# EAGLE design DoubleBoard_TypeC (EAGLE 9.5.2)
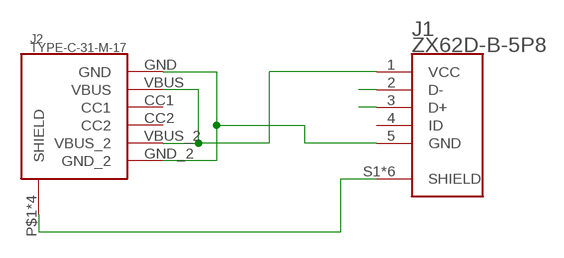
[diagram p0: schematic, sheet 1]

## Parts
J1  ZX62D-B-5P8  [HRS_ZX62D-B-5P8]
J2  TYPE-C-31-M-17  [TYPE-C-31-M-17]

## Nets
D+: J1.3(D+)
D-: J1.2(D-)
GND [power]: J1.5(GND) J2.GND J2.GND_2
SHIELD [power]: J1.S1(SHIELD) J1.S2(SHIELD) J1.S3(SHIELD) J1.S4(SHIELD) J1.S5(SHIELD) J1.S6(SHIELD) J2.P$1(SHIELD) J2.P$2(SHIELD) J2.P$3(SHIELD) J2.P$4(SHIELD)
VCC [power]: J1.1(VCC) J2.VBUS J2.VBUS_2
Unconnected: J1.4(ID) J2.CC1 J2.CC2

## Library data of the parts
J1 = angrypig7_Library:ZX62D-B-5P8: SMD+DIP Micro USB; MICRO-B-SMD; AVAILABILITY: Unavailable; DESCRIPTION: USB - micro B USB 2.0 Receptacle Connector 5 Position Surface Mount, Right Angle; Through Hole; MF: Hirose; MP: ZX62D-B-5P8; PACKAGE: None; PRICE: None
J2 = Type-C_Hroparts:TYPE-C-31-M-17

## Net classes
0 default: width 0.305 mm
1 power: width 0.61 mm

## Board
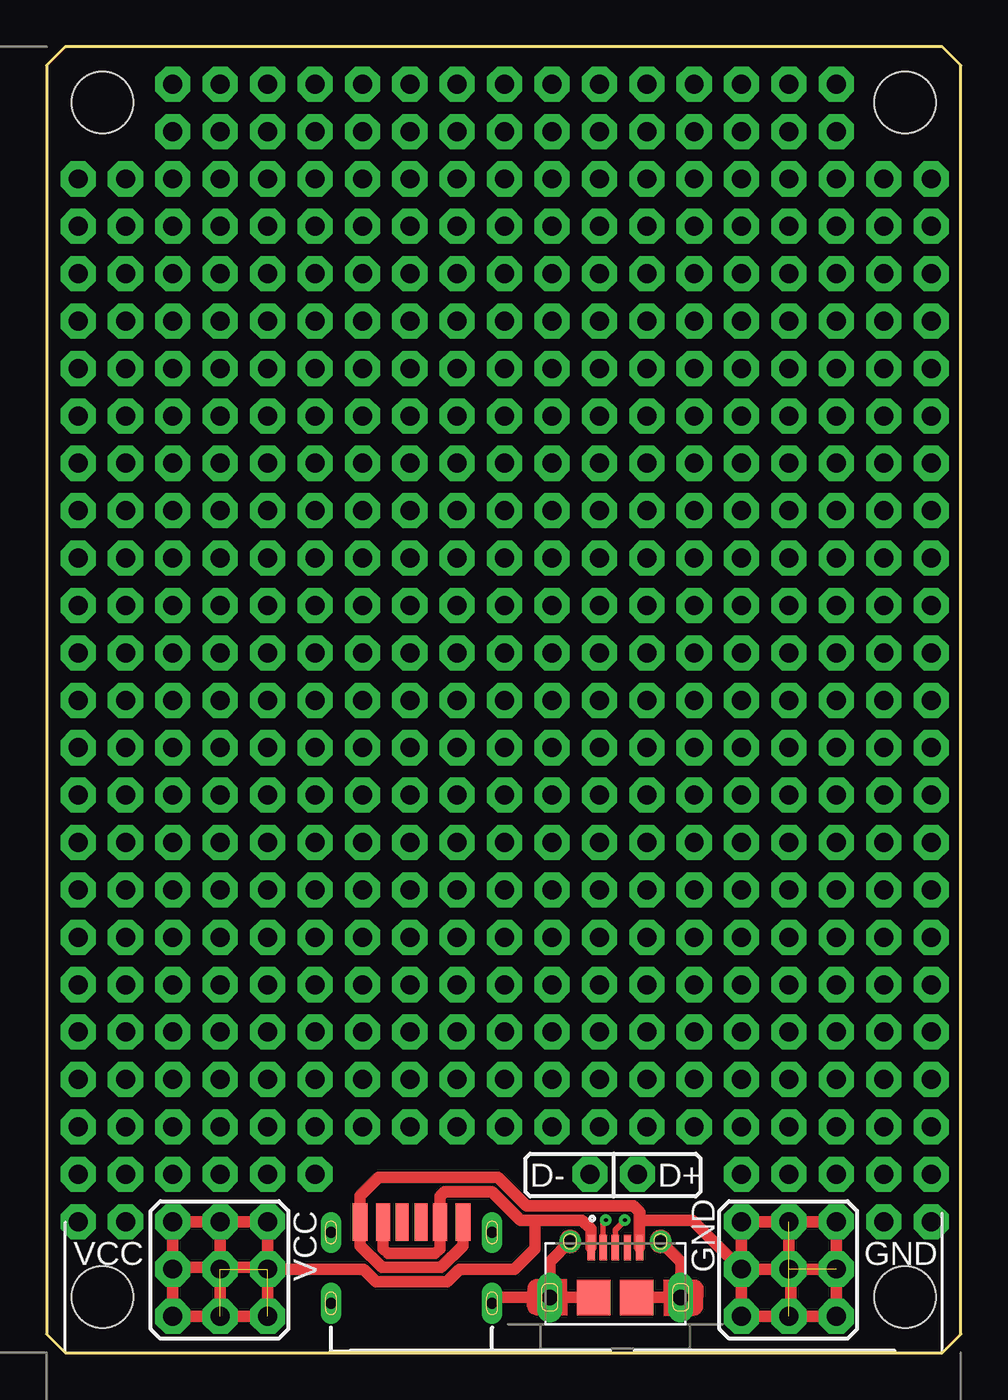
[diagram p1: board, top side]
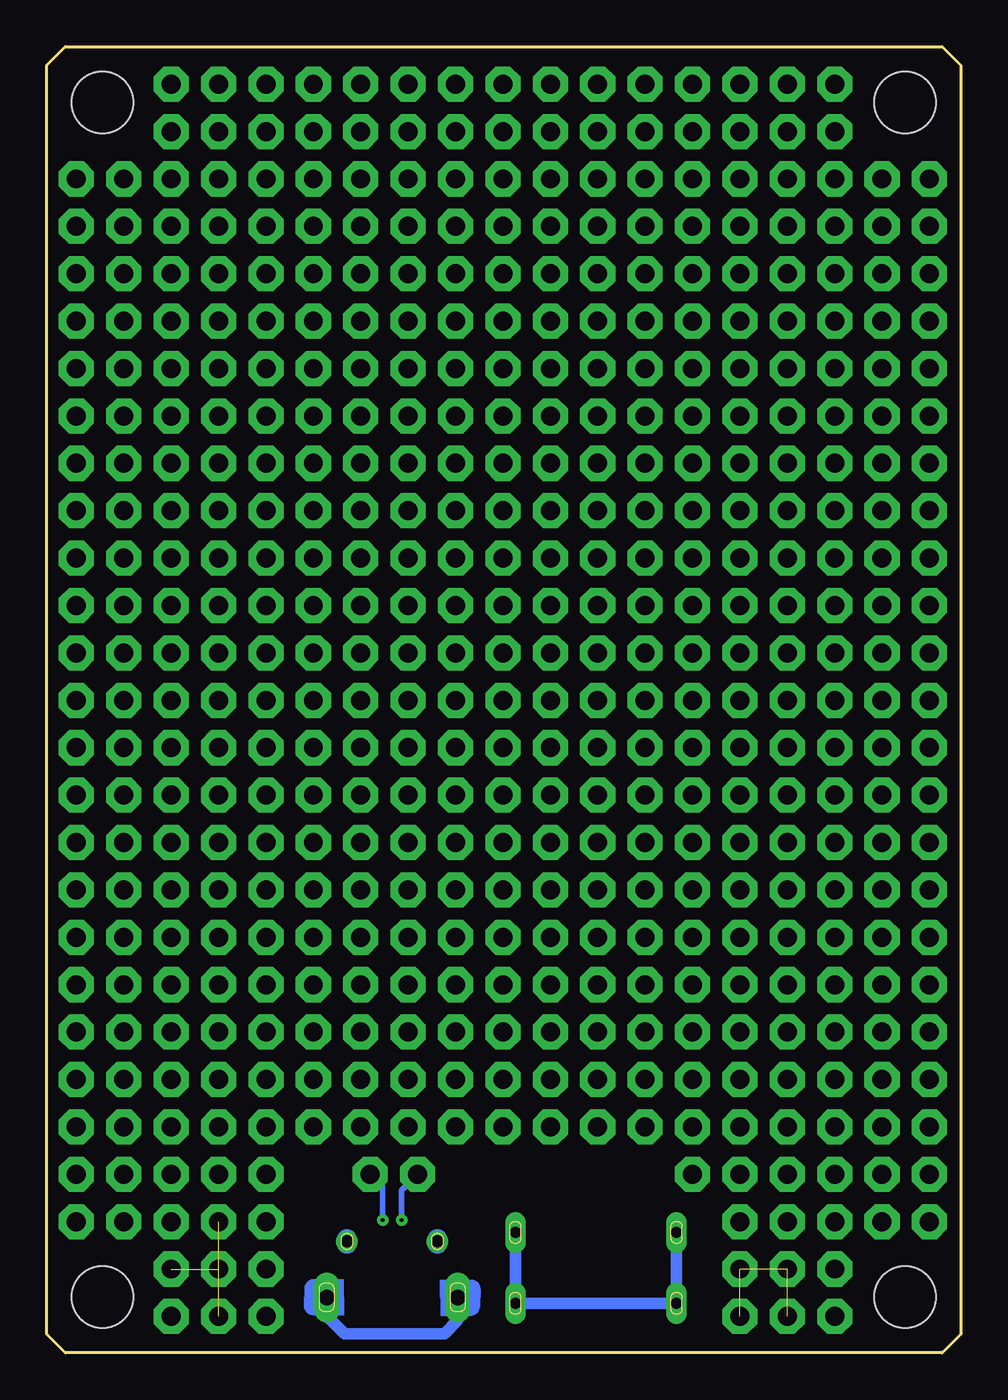
[diagram p2: board, bottom side, seen from below]

Size 49 x 70 mm. Coordinates in mm from the lower left corner, seen from the top.
Outline: 1,0 48,0 49,1 49,69 48,70 1,70 0,69 0,1 1,0
Copper layers (1*16): Top 0.035mm / dielectric 1.5mm / Bottom 0.035mm
Design rules "default *": minimum track width 6mil, minimum drill 0.35mm, track to track 6mil, track to pad 6mil, pad to pad 6mil, via to via 6mil, smd to smd 6mil, copper to edge 3mil, drill to drill 6mil, minimum pad ring 10mil, minimum via ring 8mil, stop-mask expansion 4mil, vias tented up to drill 0mil, thermal gap 10mil
Holes 3.3 mm at 3,3 46,3 46,67 3,67

### Footprints (pad centres in the part's own frame; a part is rotated, then mirrored left to right if it is on the bottom)
HRS_ZX62D-B-5P8 = smd 0.4 x 1.35: 1 -1.3,2.6; 2 -0.65,2.6; 3 0,2.6; 4 0.65,2.6; 5 1.3,2.6 | drill 0.65 pad 1.05: S1 -2.425,2.925; S2 2.425,2.925 | drill 0.825 pad 0.95 long: S3 -3.513,-0.075; S6 3.513,-0.075 | smd 1.8 x 1.9: S4 -1.15,-0.075; S5 1.15,-0.075
TYPE-C-31-M-17 = smd 0.7 x 2: CC1 -0.5,0.4; CC2 0.5,0.4 | smd 0.8 x 2: GND -2.75,0.4; GND_2 2.75,0.4 | drill 0.6 pad 1.1 long: P$1 4.32,-3.95; P$2 4.32,-0.15; P$3 -4.32,-0.15; P$4 -4.32,-3.95 | smd 0.76 x 2: VBUS -1.52,0.4; VBUS_2 1.52,0.4

### Placement (x,y rotation side)
J1  30.48,3.05 0 top
J2  19.56,6.6 0 top

### Tracks (layer width: path | path; a pad name or v marks a point on that pad's centre or on a via)
D+  (via drill 0.2, 1.02 pad 1.88)
  Top 0.305: J1.3 30.48,6.6 v30.99,7.11
  Bottom 0.305: v30.99,7.11 30.99,8.9 v31.66,9.57
D-  (via drill 0.2, 1.02 pad 1.88)
  Top 0.305: J1.2 29.83,6.97 v29.97,7.11
  Bottom 0.305: v29.12,9.57 29.97,8.72 v29.97,7.11
GND  (via drill 1.02 pad 1.88)  (3 unrouted)
  Top 0.61: J2.GND_2 22.31,5.74 21.14,4.57 17.97,4.57 16.81,5.74 J2.GND 16.81,8.43 17.78,9.4 24.19,9.4 25.72,7.87 31.44,7.87 31.79,7.53 31.78,7.52 31.78,7.11 | J1.5 31.78,7.11 | 39.88,7.03 v37.24,7.03 v37.24,1.95 39.88,1.95 | 39.88,7.03 v42.33,7.03 42.33,4.32 | 42.33,4.32 v42.33,1.95 39.88,1.95 | 42.33,4.32 42.15,4.49 v37.24,4.49 34.62,7.11 31.78,7.11 | 39.88,7.03 39.78,6.94 v39.78,4.49 39.88,4.4 39.88,1.95
  other vias: 39.79,7.03 42.33,4.49 39.79,1.95
N$2  (via drill 1.02 pad 1.88)
  other vias: 4.23,62.91
N$3  (via drill 1.02 pad 1.88)
  other vias: 6.77,62.91
N$4  (via drill 1.02 pad 1.88)
  other vias: 9.31,62.91
N$5  (via drill 1.02 pad 1.88)
  other vias: 11.85,62.91
N$6  (via drill 1.02 pad 1.88)
  other vias: 14.39,62.91
N$7  (via drill 1.02 pad 1.88)
  other vias: 16.93,62.91
N$8  (via drill 1.02 pad 1.88)
  other vias: 19.47,62.91
N$9  (via drill 1.02 pad 1.88)
  other vias: 1.69,7.03
N$10  (via drill 1.02 pad 1.88)
  other vias: 22.01,62.91
N$11  (via drill 1.02 pad 1.88)
  other vias: 24.55,62.91
N$12  (via drill 1.02 pad 1.88)
  other vias: 27.09,62.91
N$13  (via drill 1.02 pad 1.88)
  other vias: 29.63,62.91
N$14  (via drill 1.02 pad 1.88)
  other vias: 32.17,62.91
N$15  (via drill 1.02 pad 1.88)
  other vias: 34.71,62.91
N$16  (via drill 1.02 pad 1.88)
  other vias: 37.25,62.91
N$17  (via drill 1.02 pad 1.88)
  other vias: 39.79,62.91
N$18  (via drill 1.02 pad 1.88)
  other vias: 42.33,62.91
N$19  (via drill 1.02 pad 1.88)
  other vias: 44.87,62.91
N$20  (via drill 1.02 pad 1.88)
  other vias: 6.77,67.99
N$21  (via drill 1.02 pad 1.88)
  other vias: 6.77,65.45
N$22  (via drill 1.02 pad 1.88)
  other vias: 9.31,65.45
N$23  (via drill 1.02 pad 1.88)
  other vias: 11.85,65.45
N$24  (via drill 1.02 pad 1.88)
  other vias: 14.39,65.45
N$25  (via drill 1.02 pad 1.88)
  other vias: 16.93,65.45
N$26  (via drill 1.02 pad 1.88)
  other vias: 19.47,65.45
N$27  (via drill 1.02 pad 1.88)
  other vias: 47.41,7.03
N$28  (via drill 1.02 pad 1.88)
  other vias: 9.31,67.99
N$29  (via drill 1.02 pad 1.88)
  other vias: 22.01,65.45
N$30  (via drill 1.02 pad 1.88)
  other vias: 24.55,65.45
N$31  (via drill 1.02 pad 1.88)
  other vias: 27.09,65.45
N$32  (via drill 1.02 pad 1.88)
  other vias: 29.63,65.45
N$33  (via drill 1.02 pad 1.88)
  other vias: 32.17,65.45
N$34  (via drill 1.02 pad 1.88)
  other vias: 34.71,65.45
N$35  (via drill 1.02 pad 1.88)
  other vias: 37.25,65.45
N$36  (via drill 1.02 pad 1.88)
  other vias: 39.79,65.45
N$37  (via drill 1.02 pad 1.88)
  other vias: 42.33,65.45
N$38  (via drill 1.02 pad 1.88)
  other vias: 11.85,67.99
N$39  (via drill 1.02 pad 1.88)
  other vias: 14.39,67.99
N$40  (via drill 1.02 pad 1.88)
  other vias: 16.93,67.99
N$41  (via drill 1.02 pad 1.88)
  other vias: 19.47,67.99
N$42  (via drill 1.02 pad 1.88)
  other vias: 22.01,67.99
N$43  (via drill 1.02 pad 1.88)
  other vias: 24.55,67.99
N$44  (via drill 1.02 pad 1.88)
  other vias: 27.09,67.99
N$45  (via drill 1.02 pad 1.88)
  other vias: 29.63,67.99
N$46  (via drill 1.02 pad 1.88)
  other vias: 32.17,67.99
N$47  (via drill 1.02 pad 1.88)
  other vias: 1.69,9.57
N$48  (via drill 1.02 pad 1.88)
  other vias: 4.23,9.57
N$49  (via drill 1.02 pad 1.88)
  other vias: 6.77,9.57
N$50  (via drill 1.02 pad 1.88)
  other vias: 9.31,9.57
N$51  (via drill 1.02 pad 1.88)
  other vias: 11.85,9.57
N$52  (via drill 1.02 pad 1.88)
  other vias: 14.39,9.57
N$61  (via drill 1.02 pad 1.88)
  other vias: 37.25,9.57
N$62  (via drill 1.02 pad 1.88)
  other vias: 39.79,9.57
N$63  (via drill 1.02 pad 1.88)
  other vias: 42.33,9.57
N$64  (via drill 1.02 pad 1.88)
  other vias: 44.87,9.57
N$65  (via drill 1.02 pad 1.88)
  other vias: 47.41,9.57
N$66  (via drill 1.02 pad 1.88)
  other vias: 1.69,12.11
N$67  (via drill 1.02 pad 1.88)
  other vias: 4.23,12.11
N$68  (via drill 1.02 pad 1.88)
  other vias: 6.77,12.11
N$69  (via drill 1.02 pad 1.88)
  other vias: 9.31,12.11
N$70  (via drill 1.02 pad 1.88)
  other vias: 11.85,12.11
N$71  (via drill 1.02 pad 1.88)
  other vias: 14.39,12.11
N$72  (via drill 1.02 pad 1.88)
  other vias: 16.93,12.11
N$73  (via drill 1.02 pad 1.88)
  other vias: 19.47,12.11
N$74  (via drill 1.02 pad 1.88)
  other vias: 22.01,12.11
N$75  (via drill 1.02 pad 1.88)
  other vias: 24.55,12.11
N$76  (via drill 1.02 pad 1.88)
  other vias: 27.09,12.11
N$77  (via drill 1.02 pad 1.88)
  other vias: 29.63,12.11
N$78  (via drill 1.02 pad 1.88)
  other vias: 32.17,12.11
N$79  (via drill 1.02 pad 1.88)
  other vias: 34.71,12.11
N$80  (via drill 1.02 pad 1.88)
  other vias: 37.25,12.11
N$81  (via drill 1.02 pad 1.88)
  other vias: 39.79,12.11
N$82  (via drill 1.02 pad 1.88)
  other vias: 42.33,12.11
N$83  (via drill 1.02 pad 1.88)
  other vias: 44.87,12.11
N$84  (via drill 1.02 pad 1.88)
  other vias: 47.41,12.11
N$85  (via drill 1.02 pad 1.88)
  other vias: 1.69,14.65
N$86  (via drill 1.02 pad 1.88)
  other vias: 4.23,14.65
N$87  (via drill 1.02 pad 1.88)
  other vias: 6.77,14.65
N$88  (via drill 1.02 pad 1.88)
  other vias: 9.31,14.65
N$89  (via drill 1.02 pad 1.88)
  other vias: 11.85,14.65
N$90  (via drill 1.02 pad 1.88)
  other vias: 14.39,14.65
N$91  (via drill 1.02 pad 1.88)
  other vias: 16.93,14.65
N$92  (via drill 1.02 pad 1.88)
  other vias: 19.47,14.65
N$93  (via drill 1.02 pad 1.88)
  other vias: 22.01,14.65
N$94  (via drill 1.02 pad 1.88)
  other vias: 24.55,14.65
N$95  (via drill 1.02 pad 1.88)
  other vias: 27.09,14.65
N$96  (via drill 1.02 pad 1.88)
  other vias: 29.63,14.65
N$97  (via drill 1.02 pad 1.88)
  other vias: 32.17,14.65
N$98  (via drill 1.02 pad 1.88)
  other vias: 34.71,14.65
N$99  (via drill 1.02 pad 1.88)
  other vias: 37.25,14.65
N$100  (via drill 1.02 pad 1.88)
  other vias: 39.79,14.65
N$101  (via drill 1.02 pad 1.88)
  other vias: 42.33,14.65
N$102  (via drill 1.02 pad 1.88)
  other vias: 44.87,14.65
N$103  (via drill 1.02 pad 1.88)
  other vias: 47.41,14.65
N$104  (via drill 1.02 pad 1.88)
  other vias: 1.69,17.19
N$105  (via drill 1.02 pad 1.88)
  other vias: 4.23,17.19
N$106  (via drill 1.02 pad 1.88)
  other vias: 6.77,17.19
N$107  (via drill 1.02 pad 1.88)
  other vias: 9.31,17.19
N$108  (via drill 1.02 pad 1.88)
  other vias: 11.85,17.19
N$109  (via drill 1.02 pad 1.88)
  other vias: 14.39,17.19
N$110  (via drill 1.02 pad 1.88)
  other vias: 16.93,17.19
N$111  (via drill 1.02 pad 1.88)
  other vias: 19.47,17.19
N$112  (via drill 1.02 pad 1.88)
  other vias: 22.01,17.19
N$113  (via drill 1.02 pad 1.88)
  other vias: 24.55,17.19
N$114  (via drill 1.02 pad 1.88)
  other vias: 27.09,17.19
N$115  (via drill 1.02 pad 1.88)
  other vias: 29.63,17.19
N$116  (via drill 1.02 pad 1.88)
  other vias: 32.17,17.19
N$117  (via drill 1.02 pad 1.88)
  other vias: 34.71,17.19
N$118  (via drill 1.02 pad 1.88)
  other vias: 37.25,17.19
N$119  (via drill 1.02 pad 1.88)
  other vias: 39.79,17.19
N$120  (via drill 1.02 pad 1.88)
  other vias: 42.33,17.19
N$121  (via drill 1.02 pad 1.88)
  other vias: 44.87,17.19
N$122  (via drill 1.02 pad 1.88)
  other vias: 47.41,17.19
N$123  (via drill 1.02 pad 1.88)
  other vias: 1.69,19.73
N$124  (via drill 1.02 pad 1.88)
  other vias: 4.23,19.73
N$125  (via drill 1.02 pad 1.88)
  other vias: 6.77,19.73
N$126  (via drill 1.02 pad 1.88)
  other vias: 9.31,19.73
N$127  (via drill 1.02 pad 1.88)
  other vias: 11.85,19.73
N$128  (via drill 1.02 pad 1.88)
  other vias: 14.39,19.73
N$129  (via drill 1.02 pad 1.88)
  other vias: 16.93,19.73
N$130  (via drill 1.02 pad 1.88)
  other vias: 19.47,19.73
N$131  (via drill 1.02 pad 1.88)
  other vias: 22.01,19.73
N$132  (via drill 1.02 pad 1.88)
  other vias: 24.55,19.73
N$133  (via drill 1.02 pad 1.88)
  other vias: 27.09,19.73
N$134  (via drill 1.02 pad 1.88)
  other vias: 29.63,19.73
N$135  (via drill 1.02 pad 1.88)
  other vias: 32.17,19.73
N$136  (via drill 1.02 pad 1.88)
  other vias: 34.71,19.73
N$137  (via drill 1.02 pad 1.88)
  other vias: 37.25,19.73
N$138  (via drill 1.02 pad 1.88)
  other vias: 39.79,19.73
N$139  (via drill 1.02 pad 1.88)
  other vias: 42.33,19.73
N$140  (via drill 1.02 pad 1.88)
  other vias: 44.87,19.73
N$141  (via drill 1.02 pad 1.88)
  other vias: 47.41,19.73
N$142  (via drill 1.02 pad 1.88)
  other vias: 1.69,22.27
N$143  (via drill 1.02 pad 1.88)
  other vias: 4.23,22.27
N$144  (via drill 1.02 pad 1.88)
  other vias: 6.77,22.27
N$145  (via drill 1.02 pad 1.88)
  other vias: 9.31,22.27
N$146  (via drill 1.02 pad 1.88)
  other vias: 11.85,22.27
N$147  (via drill 1.02 pad 1.88)
  other vias: 14.39,22.27
N$148  (via drill 1.02 pad 1.88)
  other vias: 16.93,22.27
N$149  (via drill 1.02 pad 1.88)
  other vias: 19.47,22.27
N$150  (via drill 1.02 pad 1.88)
  other vias: 22.01,22.27
N$151  (via drill 1.02 pad 1.88)
  other vias: 24.55,22.27
N$152  (via drill 1.02 pad 1.88)
  other vias: 27.09,22.27
N$153  (via drill 1.02 pad 1.88)
  other vias: 29.63,22.27
N$154  (via drill 1.02 pad 1.88)
  other vias: 32.17,22.27
N$155  (via drill 1.02 pad 1.88)
  other vias: 34.71,22.27
N$156  (via drill 1.02 pad 1.88)
  other vias: 37.25,22.27
N$157  (via drill 1.02 pad 1.88)
  other vias: 39.79,22.27
N$158  (via drill 1.02 pad 1.88)
  other vias: 42.33,22.27
N$159  (via drill 1.02 pad 1.88)
  other vias: 44.87,22.27
N$160  (via drill 1.02 pad 1.88)
  other vias: 47.41,22.27
N$161  (via drill 1.02 pad 1.88)
  other vias: 1.69,24.81
N$162  (via drill 1.02 pad 1.88)
  other vias: 4.23,24.81
N$163  (via drill 1.02 pad 1.88)
  other vias: 6.77,24.81
N$164  (via drill 1.02 pad 1.88)
  other vias: 9.31,24.81
N$165  (via drill 1.02 pad 1.88)
  other vias: 11.85,24.81
N$166  (via drill 1.02 pad 1.88)
  other vias: 14.39,24.81
N$167  (via drill 1.02 pad 1.88)
  other vias: 16.93,24.81
N$168  (via drill 1.02 pad 1.88)
  other vias: 19.47,24.81
N$169  (via drill 1.02 pad 1.88)
  other vias: 22.01,24.81
N$170  (via drill 1.02 pad 1.88)
  other vias: 24.55,24.81
N$171  (via drill 1.02 pad 1.88)
  other vias: 27.09,24.81
N$172  (via drill 1.02 pad 1.88)
  other vias: 29.63,24.81
N$173  (via drill 1.02 pad 1.88)
  other vias: 32.17,24.81
N$174  (via drill 1.02 pad 1.88)
  other vias: 34.71,24.81
N$175  (via drill 1.02 pad 1.88)
  other vias: 37.25,24.81
N$176  (via drill 1.02 pad 1.88)
  other vias: 39.79,24.81
N$177  (via drill 1.02 pad 1.88)
  other vias: 42.33,24.81
N$178  (via drill 1.02 pad 1.88)
  other vias: 44.87,24.81
N$179  (via drill 1.02 pad 1.88)
  other vias: 47.41,24.81
N$180  (via drill 1.02 pad 1.88)
  other vias: 1.69,27.35
N$181  (via drill 1.02 pad 1.88)
  other vias: 4.23,27.35
N$182  (via drill 1.02 pad 1.88)
  other vias: 6.77,27.35
N$183  (via drill 1.02 pad 1.88)
  other vias: 9.31,27.35
N$184  (via drill 1.02 pad 1.88)
  other vias: 11.85,27.35
N$185  (via drill 1.02 pad 1.88)
  other vias: 14.39,27.35
N$186  (via drill 1.02 pad 1.88)
  other vias: 16.93,27.35
N$187  (via drill 1.02 pad 1.88)
  other vias: 19.47,27.35
N$188  (via drill 1.02 pad 1.88)
  other vias: 22.01,27.35
N$189  (via drill 1.02 pad 1.88)
  other vias: 24.55,27.35
N$190  (via drill 1.02 pad 1.88)
  other vias: 27.09,27.35
N$191  (via drill 1.02 pad 1.88)
  other vias: 29.63,27.35
N$192  (via drill 1.02 pad 1.88)
  other vias: 32.17,27.35
N$193  (via drill 1.02 pad 1.88)
  other vias: 34.71,27.35
N$194  (via drill 1.02 pad 1.88)
  other vias: 37.25,27.35
N$195  (via drill 1.02 pad 1.88)
  other vias: 39.79,27.35
N$196  (via drill 1.02 pad 1.88)
  other vias: 42.33,27.35
N$197  (via drill 1.02 pad 1.88)
  other vias: 44.87,27.35
N$198  (via drill 1.02 pad 1.88)
  other vias: 47.41,27.35
N$199  (via drill 1.02 pad 1.88)
  other vias: 1.69,29.89
N$200  (via drill 1.02 pad 1.88)
  other vias: 4.23,29.89
N$201  (via drill 1.02 pad 1.88)
  other vias: 6.77,29.89
N$202  (via drill 1.02 pad 1.88)
  other vias: 9.31,29.89
N$203  (via drill 1.02 pad 1.88)
  other vias: 11.85,29.89
N$204  (via drill 1.02 pad 1.88)
  other vias: 14.39,29.89
N$205  (via drill 1.02 pad 1.88)
  other vias: 16.93,29.89
N$206  (via drill 1.02 pad 1.88)
  other vias: 19.47,29.89
N$207  (via drill 1.02 pad 1.88)
  other vias: 22.01,29.89
N$208  (via drill 1.02 pad 1.88)
  other vias: 24.55,29.89
N$209  (via drill 1.02 pad 1.88)
  other vias: 27.09,29.89
N$210  (via drill 1.02 pad 1.88)
  other vias: 29.63,29.89
N$211  (via drill 1.02 pad 1.88)
  other vias: 32.17,29.89
N$212  (via drill 1.02 pad 1.88)
  other vias: 34.71,29.89
N$213  (via drill 1.02 pad 1.88)
  other vias: 37.25,29.89
N$214  (via drill 1.02 pad 1.88)
  other vias: 39.79,29.89
N$215  (via drill 1.02 pad 1.88)
  other vias: 42.33,29.89
N$216  (via drill 1.02 pad 1.88)
  other vias: 44.87,29.89
N$217  (via drill 1.02 pad 1.88)
  other vias: 47.41,29.89
N$218  (via drill 1.02 pad 1.88)
  other vias: 1.69,32.43
N$219  (via drill 1.02 pad 1.88)
  other vias: 4.23,32.43
N$220  (via drill 1.02 pad 1.88)
  other vias: 6.77,32.43
N$221  (via drill 1.02 pad 1.88)
  other vias: 9.31,32.43
N$222  (via drill 1.02 pad 1.88)
  other vias: 11.85,32.43
N$223  (via drill 1.02 pad 1.88)
  other vias: 14.39,32.43
N$224  (via drill 1.02 pad 1.88)
  other vias: 16.93,32.43
N$225  (via drill 1.02 pad 1.88)
  other vias: 19.47,32.43
N$226  (via drill 1.02 pad 1.88)
  other vias: 22.01,32.43
N$227  (via drill 1.02 pad 1.88)
  other vias: 24.55,32.43
N$228  (via drill 1.02 pad 1.88)
  other vias: 27.09,32.43
N$229  (via drill 1.02 pad 1.88)
  other vias: 29.63,32.43
N$230  (via drill 1.02 pad 1.88)
  other vias: 32.17,32.43
N$231  (via drill 1.02 pad 1.88)
  other vias: 34.71,32.43
N$232  (via drill 1.02 pad 1.88)
  other vias: 37.25,32.43
N$233  (via drill 1.02 pad 1.88)
  other vias: 39.79,32.43
N$234  (via drill 1.02 pad 1.88)
  other vias: 42.33,32.43
N$235  (via drill 1.02 pad 1.88)
  other vias: 44.87,32.43
N$236  (via drill 1.02 pad 1.88)
  other vias: 47.41,32.43
N$237  (via drill 1.02 pad 1.88)
  other vias: 1.69,34.97
N$238  (via drill 1.02 pad 1.88)
  other vias: 4.23,34.97
N$239  (via drill 1.02 pad 1.88)
  other vias: 6.77,34.97
N$240  (via drill 1.02 pad 1.88)
  other vias: 9.31,34.97
N$241  (via drill 1.02 pad 1.88)
  other vias: 11.85,34.97
N$242  (via drill 1.02 pad 1.88)
  other vias: 14.39,34.97
N$243  (via drill 1.02 pad 1.88)
  other vias: 16.93,34.97
N$244  (via drill 1.02 pad 1.88)
  other vias: 19.47,34.97
N$245  (via drill 1.02 pad 1.88)
  other vias: 22.01,34.97
N$246  (via drill 1.02 pad 1.88)
  other vias: 24.55,34.97
N$247  (via drill 1.02 pad 1.88)
  other vias: 27.09,34.97
N$248  (via drill 1.02 pad 1.88)
  other vias: 29.63,34.97
N$249  (via drill 1.02 pad 1.88)
  other vias: 32.17,34.97
N$250  (via drill 1.02 pad 1.88)
  other vias: 34.71,34.97
N$251  (via drill 1.02 pad 1.88)
  other vias: 37.25,34.97
N$252  (via drill 1.02 pad 1.88)
  other vias: 39.79,34.97
N$253  (via drill 1.02 pad 1.88)
  other vias: 42.33,34.97
N$254  (via drill 1.02 pad 1.88)
  other vias: 44.87,34.97
N$255  (via drill 1.02 pad 1.88)
  other vias: 47.41,34.97
N$256  (via drill 1.02 pad 1.88)
  other vias: 1.69,37.51
N$257  (via drill 1.02 pad 1.88)
  other vias: 4.23,37.51
N$258  (via drill 1.02 pad 1.88)
  other vias: 6.77,37.51
N$259  (via drill 1.02 pad 1.88)
  other vias: 9.31,37.51
N$260  (via drill 1.02 pad 1.88)
  other vias: 11.85,37.51
N$261  (via drill 1.02 pad 1.88)
  other vias: 14.39,37.51
N$262  (via drill 1.02 pad 1.88)
  other vias: 16.93,37.51
N$263  (via drill 1.02 pad 1.88)
  other vias: 19.47,37.51
N$264  (via drill 1.02 pad 1.88)
  other vias: 22.01,37.51
N$265  (via drill 1.02 pad 1.88)
  other vias: 24.55,37.51
N$266  (via drill 1.02 pad 1.88)
  other vias: 27.09,37.51
N$267  (via drill 1.02 pad 1.88)
  other vias: 29.63,37.51
N$268  (via drill 1.02 pad 1.88)
  other vias: 32.17,37.51
N$269  (via drill 1.02 pad 1.88)
  other vias: 34.71,37.51
N$270  (via drill 1.02 pad 1.88)
  other vias: 37.25,37.51
N$271  (via drill 1.02 pad 1.88)
  other vias: 39.79,37.51
N$272  (via drill 1.02 pad 1.88)
  other vias: 42.33,37.51
N$273  (via drill 1.02 pad 1.88)
  other vias: 44.87,37.51
N$274  (via drill 1.02 pad 1.88)
  other vias: 47.41,37.51
N$275  (via drill 1.02 pad 1.88)
  other vias: 1.69,40.05
N$276  (via drill 1.02 pad 1.88)
  other vias: 4.23,40.05
N$277  (via drill 1.02 pad 1.88)
  other vias: 6.77,40.05
N$278  (via drill 1.02 pad 1.88)
  other vias: 9.31,40.05
N$279  (via drill 1.02 pad 1.88)
  other vias: 11.85,40.05
N$280  (via drill 1.02 pad 1.88)
  other vias: 14.39,40.05
N$281  (via drill 1.02 pad 1.88)
  other vias: 16.93,40.05
N$282  (via drill 1.02 pad 1.88)
  other vias: 19.47,40.05
N$283  (via drill 1.02 pad 1.88)
  other vias: 22.01,40.05
N$284  (via drill 1.02 pad 1.88)
  other vias: 24.55,40.05
N$285  (via drill 1.02 pad 1.88)
  other vias: 27.09,40.05
N$286  (via drill 1.02 pad 1.88)
  other vias: 29.63,40.05
N$287  (via drill 1.02 pad 1.88)
  other vias: 32.17,40.05
N$288  (via drill 1.02 pad 1.88)
  other vias: 34.71,40.05
N$289  (via drill 1.02 pad 1.88)
  other vias: 37.25,40.05
N$290  (via drill 1.02 pad 1.88)
  other vias: 39.79,40.05
N$291  (via drill 1.02 pad 1.88)
  other vias: 42.33,40.05
N$292  (via drill 1.02 pad 1.88)
  other vias: 44.87,40.05
N$293  (via drill 1.02 pad 1.88)
  other vias: 47.41,40.05
N$294  (via drill 1.02 pad 1.88)
  other vias: 1.69,42.59
N$295  (via drill 1.02 pad 1.88)
  other vias: 4.23,42.59
N$296  (via drill 1.02 pad 1.88)
  other vias: 6.77,42.59
N$297  (via drill 1.02 pad 1.88)
  other vias: 9.31,42.59
N$298  (via drill 1.02 pad 1.88)
  other vias: 11.85,42.59
N$299  (via drill 1.02 pad 1.88)
  other vias: 14.39,42.59
N$300  (via drill 1.02 pad 1.88)
  other vias: 16.93,42.59
N$301  (via drill 1.02 pad 1.88)
  other vias: 19.47,42.59
N$302  (via drill 1.02 pad 1.88)
  other vias: 22.01,42.59
N$303  (via drill 1.02 pad 1.88)
  other vias: 24.55,42.59
N$304  (via drill 1.02 pad 1.88)
  other vias: 27.09,42.59
N$305  (via drill 1.02 pad 1.88)
  other vias: 29.63,42.59
N$306  (via drill 1.02 pad 1.88)
  other vias: 32.17,42.59
N$307  (via drill 1.02 pad 1.88)
  other vias: 34.71,42.59
N$308  (via drill 1.02 pad 1.88)
  other vias: 37.25,42.59
N$309  (via drill 1.02 pad 1.88)
  other vias: 39.79,42.59
N$310  (via drill 1.02 pad 1.88)
  other vias: 42.33,42.59
N$311  (via drill 1.02 pad 1.88)
  other vias: 44.87,42.59
N$312  (via drill 1.02 pad 1.88)
  other vias: 47.41,42.59
N$313  (via drill 1.02 pad 1.88)
  other vias: 1.69,45.13
N$314  (via drill 1.02 pad 1.88)
  other vias: 4.23,45.13
N$315  (via drill 1.02 pad 1.88)
  other vias: 6.77,45.13
N$316  (via drill 1.02 pad 1.88)
  other vias: 9.31,45.13
N$317  (via drill 1.02 pad 1.88)
  other vias: 11.85,45.13
N$318  (via drill 1.02 pad 1.88)
  other vias: 14.39,45.13
N$319  (via drill 1.02 pad 1.88)
  other vias: 16.93,45.13
N$320  (via drill 1.02 pad 1.88)
  other vias: 19.47,45.13
N$321  (via drill 1.02 pad 1.88)
  other vias: 22.01,45.13
N$322  (via drill 1.02 pad 1.88)
  other vias: 24.55,45.13
N$323  (via drill 1.02 pad 1.88)
  other vias: 27.09,45.13
N$324  (via drill 1.02 pad 1.88)
  other vias: 29.63,45.13
N$325  (via drill 1.02 pad 1.88)
  other vias: 32.17,45.13
N$326  (via drill 1.02 pad 1.88)
  other vias: 34.71,45.13
N$327  (via drill 1.02 pad 1.88)
  other vias: 37.25,45.13
N$328  (via drill 1.02 pad 1.88)
  other vias: 39.79,45.13
N$329  (via drill 1.02 pad 1.88)
  other vias: 42.33,45.13
N$330  (via drill 1.02 pad 1.88)
  other vias: 44.87,45.13
N$331  (via drill 1.02 pad 1.88)
  other vias: 47.41,45.13
N$332  (via drill 1.02 pad 1.88)
  other vias: 1.69,47.67
N$333  (via drill 1.02 pad 1.88)
  other vias: 4.23,47.67
N$334  (via drill 1.02 pad 1.88)
  other vias: 6.77,47.67
N$335  (via drill 1.02 pad 1.88)
  other vias: 9.31,47.67
N$336  (via drill 1.02 pad 1.88)
  other vias: 11.85,47.67
N$337  (via drill 1.02 pad 1.88)
  other vias: 14.39,47.67
N$338  (via drill 1.02 pad 1.88)
  other vias: 16.93,47.67
N$339  (via drill 1.02 pad 1.88)
  other vias: 19.47,47.67
N$340  (via drill 1.02 pad 1.88)
  other vias: 22.01,47.67
N$341  (via drill 1.02 pad 1.88)
  other vias: 24.55,47.67
N$342  (via drill 1.02 pad 1.88)
  other vias: 27.09,47.67
N$343  (via drill 1.02 pad 1.88)
  other vias: 29.63,47.67
N$344  (via drill 1.02 pad 1.88)
  other vias: 32.17,47.67
N$345  (via drill 1.02 pad 1.88)
  other vias: 34.71,47.67
N$346  (via drill 1.02 pad 1.88)
  other vias: 37.25,47.67
N$347  (via drill 1.02 pad 1.88)
  other vias: 39.79,47.67
N$348  (via drill 1.02 pad 1.88)
  other vias: 42.33,47.67
N$349  (via drill 1.02 pad 1.88)
  other vias: 44.87,47.67
N$350  (via drill 1.02 pad 1.88)
  other vias: 47.41,47.67
N$351  (via drill 1.02 pad 1.88)
  other vias: 1.69,50.21
N$352  (via drill 1.02 pad 1.88)
  other vias: 4.23,50.21
N$353  (via drill 1.02 pad 1.88)
  other vias: 6.77,50.21
N$354  (via drill 1.02 pad 1.88)
  other vias: 9.31,50.21
N$355  (via drill 1.02 pad 1.88)
  other vias: 11.85,50.21
N$356  (via drill 1.02 pad 1.88)
  other vias: 14.39,50.21
N$357  (via drill 1.02 pad 1.88)
  other vias: 16.93,50.21
N$358  (via drill 1.02 pad 1.88)
  other vias: 19.47,50.21
N$359  (via drill 1.02 pad 1.88)
  other vias: 22.01,50.21
N$360  (via drill 1.02 pad 1.88)
  other vias: 24.55,50.21
N$361  (via drill 1.02 pad 1.88)
  other vias: 27.09,50.21
N$362  (via drill 1.02 pad 1.88)
  other vias: 29.63,50.21
N$363  (via drill 1.02 pad 1.88)
  other vias: 32.17,50.21
N$364  (via drill 1.02 pad 1.88)
  other vias: 34.71,50.21
N$365  (via drill 1.02 pad 1.88)
  other vias: 37.25,50.21
N$366  (via drill 1.02 pad 1.88)
  other vias: 39.79,50.21
N$367  (via drill 1.02 pad 1.88)
  other vias: 42.33,50.21
N$368  (via drill 1.02 pad 1.88)
  other vias: 44.87,50.21
N$369  (via drill 1.02 pad 1.88)
  other vias: 47.41,50.21
N$370  (via drill 1.02 pad 1.88)
  other vias: 1.69,52.75
N$371  (via drill 1.02 pad 1.88)
  other vias: 4.23,52.75
N$372  (via drill 1.02 pad 1.88)
  other vias: 6.77,52.75
N$373  (via drill 1.02 pad 1.88)
  other vias: 9.31,52.75
N$374  (via drill 1.02 pad 1.88)
  other vias: 11.85,52.75
N$375  (via drill 1.02 pad 1.88)
  other vias: 14.39,52.75
N$376  (via drill 1.02 pad 1.88)
  other vias: 16.93,52.75
N$377  (via drill 1.02 pad 1.88)
  other vias: 19.47,52.75
N$378  (via drill 1.02 pad 1.88)
  other vias: 22.01,52.75
N$379  (via drill 1.02 pad 1.88)
  other vias: 24.55,52.75
N$380  (via drill 1.02 pad 1.88)
  other vias: 27.09,52.75
N$381  (via drill 1.02 pad 1.88)
  other vias: 29.63,52.75
N$382  (via drill 1.02 pad 1.88)
  other vias: 32.17,52.75
N$383  (via drill 1.02 pad 1.88)
  other vias: 34.71,52.75
N$384  (via drill 1.02 pad 1.88)
  other vias: 37.25,52.75
N$385  (via drill 1.02 pad 1.88)
  other vias: 39.79,52.75
N$386  (via drill 1.02 pad 1.88)
  other vias: 42.33,52.75
N$387  (via drill 1.02 pad 1.88)
  other vias: 44.87,52.75
N$388  (via drill 1.02 pad 1.88)
  other vias: 47.41,52.75
N$389  (via drill 1.02 pad 1.88)
  other vias: 1.69,55.29
N$390  (via drill 1.02 pad 1.88)
  other vias: 4.23,55.29
N$391  (via drill 1.02 pad 1.88)
  other vias: 6.77,55.29
N$392  (via drill 1.02 pad 1.88)
  other vias: 9.31,55.29
N$393  (via drill 1.02 pad 1.88)
  other vias: 11.85,55.29
N$394  (via drill 1.02 pad 1.88)
  other vias: 14.39,55.29
N$395  (via drill 1.02 pad 1.88)
  other vias: 16.93,55.29
N$396  (via drill 1.02 pad 1.88)
  other vias: 19.47,55.29
N$397  (via drill 1.02 pad 1.88)
  other vias: 22.01,55.29
N$398  (via drill 1.02 pad 1.88)
  other vias: 24.55,55.29
N$399  (via drill 1.02 pad 1.88)
  other vias: 27.09,55.29
N$400  (via drill 1.02 pad 1.88)
  other vias: 29.63,55.29
N$401  (via drill 1.02 pad 1.88)
  other vias: 32.17,55.29
N$402  (via drill 1.02 pad 1.88)
  other vias: 34.71,55.29
N$403  (via drill 1.02 pad 1.88)
  other vias: 37.25,55.29
N$404  (via drill 1.02 pad 1.88)
  other vias: 39.79,55.29
N$405  (via drill 1.02 pad 1.88)
  other vias: 42.33,55.29
N$406  (via drill 1.02 pad 1.88)
  other vias: 44.87,55.29
N$407  (via drill 1.02 pad 1.88)
  other vias: 47.41,55.29
N$408  (via drill 1.02 pad 1.88)
  other vias: 1.69,57.83
N$409  (via drill 1.02 pad 1.88)
  other vias: 4.23,57.83
N$410  (via drill 1.02 pad 1.88)
  other vias: 6.77,57.83
N$411  (via drill 1.02 pad 1.88)
  other vias: 9.31,57.83
N$412  (via drill 1.02 pad 1.88)
  other vias: 11.85,57.83
N$413  (via drill 1.02 pad 1.88)
  other vias: 14.39,57.83
N$414  (via drill 1.02 pad 1.88)
  other vias: 16.93,57.83
N$415  (via drill 1.02 pad 1.88)
  other vias: 19.47,57.83
N$416  (via drill 1.02 pad 1.88)
  other vias: 22.01,57.83
N$417  (via drill 1.02 pad 1.88)
  other vias: 24.55,57.83
N$418  (via drill 1.02 pad 1.88)
  other vias: 27.09,57.83
N$419  (via drill 1.02 pad 1.88)
  other vias: 29.63,57.83
N$420  (via drill 1.02 pad 1.88)
  other vias: 32.17,57.83
N$421  (via drill 1.02 pad 1.88)
  other vias: 34.71,57.83
N$422  (via drill 1.02 pad 1.88)
  other vias: 37.25,57.83
N$423  (via drill 1.02 pad 1.88)
  other vias: 39.79,57.83
N$424  (via drill 1.02 pad 1.88)
  other vias: 42.33,57.83
N$425  (via drill 1.02 pad 1.88)
  other vias: 44.87,57.83
N$426  (via drill 1.02 pad 1.88)
  other vias: 47.41,57.83
N$427  (via drill 1.02 pad 1.88)
  other vias: 1.69,60.37
N$428  (via drill 1.02 pad 1.88)
  other vias: 4.23,60.37
N$429  (via drill 1.02 pad 1.88)
  other vias: 6.77,60.37
N$430  (via drill 1.02 pad 1.88)
  other vias: 9.31,60.37
N$431  (via drill 1.02 pad 1.88)
  other vias: 11.85,60.37
N$432  (via drill 1.02 pad 1.88)
  other vias: 14.39,60.37
N$433  (via drill 1.02 pad 1.88)
  other vias: 16.93,60.37
N$434  (via drill 1.02 pad 1.88)
  other vias: 19.47,60.37
N$435  (via drill 1.02 pad 1.88)
  other vias: 22.01,60.37
N$436  (via drill 1.02 pad 1.88)
  other vias: 24.55,60.37
N$437  (via drill 1.02 pad 1.88)
  other vias: 27.09,60.37
N$438  (via drill 1.02 pad 1.88)
  other vias: 29.63,60.37
N$439  (via drill 1.02 pad 1.88)
  other vias: 32.17,60.37
N$440  (via drill 1.02 pad 1.88)
  other vias: 34.71,60.37
N$441  (via drill 1.02 pad 1.88)
  other vias: 37.25,60.37
N$442  (via drill 1.02 pad 1.88)
  other vias: 39.79,60.37
N$443  (via drill 1.02 pad 1.88)
  other vias: 42.33,60.37
N$444  (via drill 1.02 pad 1.88)
  other vias: 44.87,60.37
N$445  (via drill 1.02 pad 1.88)
  other vias: 47.41,60.37
N$446  (via drill 1.02 pad 1.88)
  other vias: 1.69,62.91
N$447  (via drill 1.02 pad 1.88)
  other vias: 34.71,67.99
N$448  (via drill 1.02 pad 1.88)
  other vias: 37.25,67.99
N$449  (via drill 1.02 pad 1.88)
  other vias: 39.79,67.99
N$450  (via drill 1.02 pad 1.88)
  other vias: 42.33,67.99
N$451  (via drill 1.02 pad 1.88)
  other vias: 44.87,7.03
N$452  (via drill 1.02 pad 1.88)
  other vias: 4.23,7.03
N$464  (via drill 1.02 pad 1.88)
  other vias: 47.41,62.91
SHIELD
  Top 0.61: J1.S2 33.99,4.89 J1.S6 J1.S5 32.23,2.97 | J1.S1 26.97,4.89 J1.S3 | J1.S3 24.2,2.97 J2.P$1 | J1.S3 J1.S4
  Bottom 0.61: J2.P$3 J2.P$4 J2.P$1 J2.P$2 | J1.S3 26.97,1.73 27.69,1.02 33.02,1.02 33.99,1.99 J1.S6
VCC  (via drill 1.02 pad 1.88)  (3 unrouted)
  Top 0.61: J2.VBUS 18.04,5.58 18.29,5.33 20.83,5.33 21.08,5.58 J2.VBUS_2 21.08,8.38 21.34,8.64 23.88,8.64 25.4,7.11 26.16,7.11 | 26.16,7.11 28.7,7.11 29.18,6.63 J1.1 | 9.14,1.95 v6.76,1.95 v6.76,7.03 v11.85,7.03 11.85,4.57 | 9.14,1.95 v11.85,1.95 11.85,4.57 | v6.76,4.49 6.85,4.57 11.85,4.57 | v9.3,7.03 9.3,2.11 9.14,1.95 | v11.85,4.49 16.98,4.49 17.66,3.81 21.46,3.81 22.14,4.49 25.07,4.49 26.16,5.59 26.16,7.11
  other vias: 9.31,4.49 9.31,1.95

### Text on the board
tPlace: D- | D+ | VCC | VCC | GND | GND